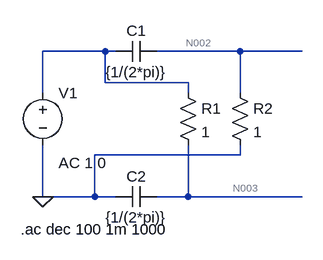
[diagram p0: schematic Draft1.asc]
Draft1.asc, the LTspice schematic file:
Version 4
SHEET 1 880 680
WIRE 80 80 -16 80
WIRE 96 80 80 80
WIRE 288 80 160 80
WIRE 384 80 288 80
WIRE 80 128 80 80
WIRE 208 128 80 128
WIRE -16 144 -16 80
WIRE 208 144 208 128
WIRE 288 144 288 80
WIRE 288 240 288 224
WIRE 288 240 64 240
WIRE -16 304 -16 224
WIRE 64 304 64 240
WIRE 64 304 -16 304
WIRE 96 304 64 304
WIRE 208 304 208 224
WIRE 208 304 160 304
WIRE 384 304 208 304
FLAG -16 304 0
SYMBOL voltage -16 128 R0
WINDOW 123 24 124 Left 2
WINDOW 39 0 0 Left 0
SYMATTR InstName V1
SYMATTR Value ""
SYMATTR Value2 AC 1 0
SYMBOL cap 160 64 R90
WINDOW 0 0 32 VBottom 2
WINDOW 3 32 32 VTop 2
SYMATTR InstName C1
SYMATTR Value {1/(2*pi)}
SYMBOL cap 160 288 R90
WINDOW 0 0 32 VBottom 2
WINDOW 3 32 32 VTop 2
SYMATTR InstName C2
SYMATTR Value {1/(2*pi)}
SYMBOL res 192 128 R0
SYMATTR InstName R1
SYMATTR Value 1
SYMBOL res 272 128 R0
SYMATTR InstName R2
SYMATTR Value 1
TEXT -50 354 Left 2 !.ac dec 100 1m 1000

The netlist it stands for:
* Draft1.asc
V1 N001 0 AC 1 0
C1 N002 N001 {1/(2*pi)}
C2 N003 0 {1/(2*pi)}
R1 N001 N003 1
R2 N002 0 1
.ac dec 100 1m 1000
.backanno
.end

* Results of the author's LTspice run, read from the files saved beside the schematic
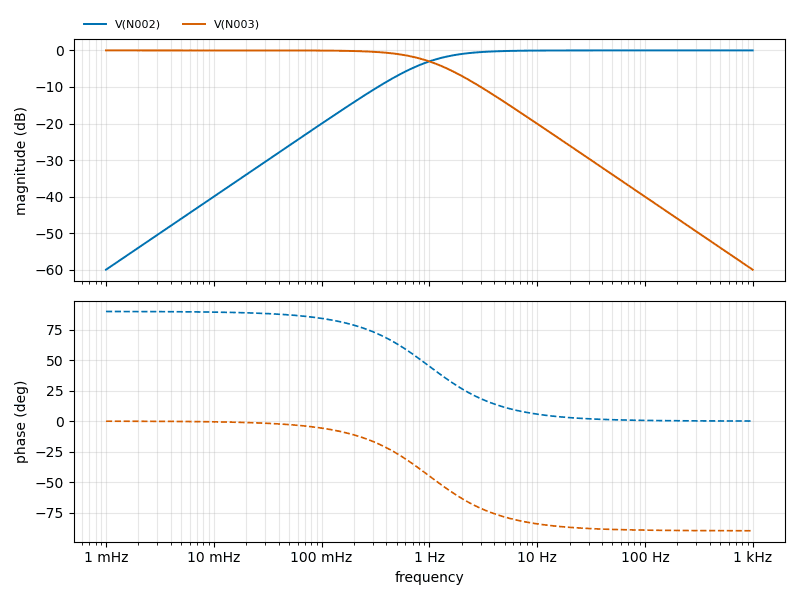
[diagram p1: AC Analysis of Draft1.asc, plotted from the saved traces]
* AC Analysis, 1 run:
*   V(N002): -60.00 dB at 1 mHz, -0.00 dB at 1 kHz, peak -0.00 dB at 1 kHz, 3 dB below the peak at 1 Hz
*   V(N003): -0.00 dB at 1 mHz, -60.00 dB at 1 kHz, peak -0.00 dB at 1 mHz, 3 dB below the peak at 1 Hz